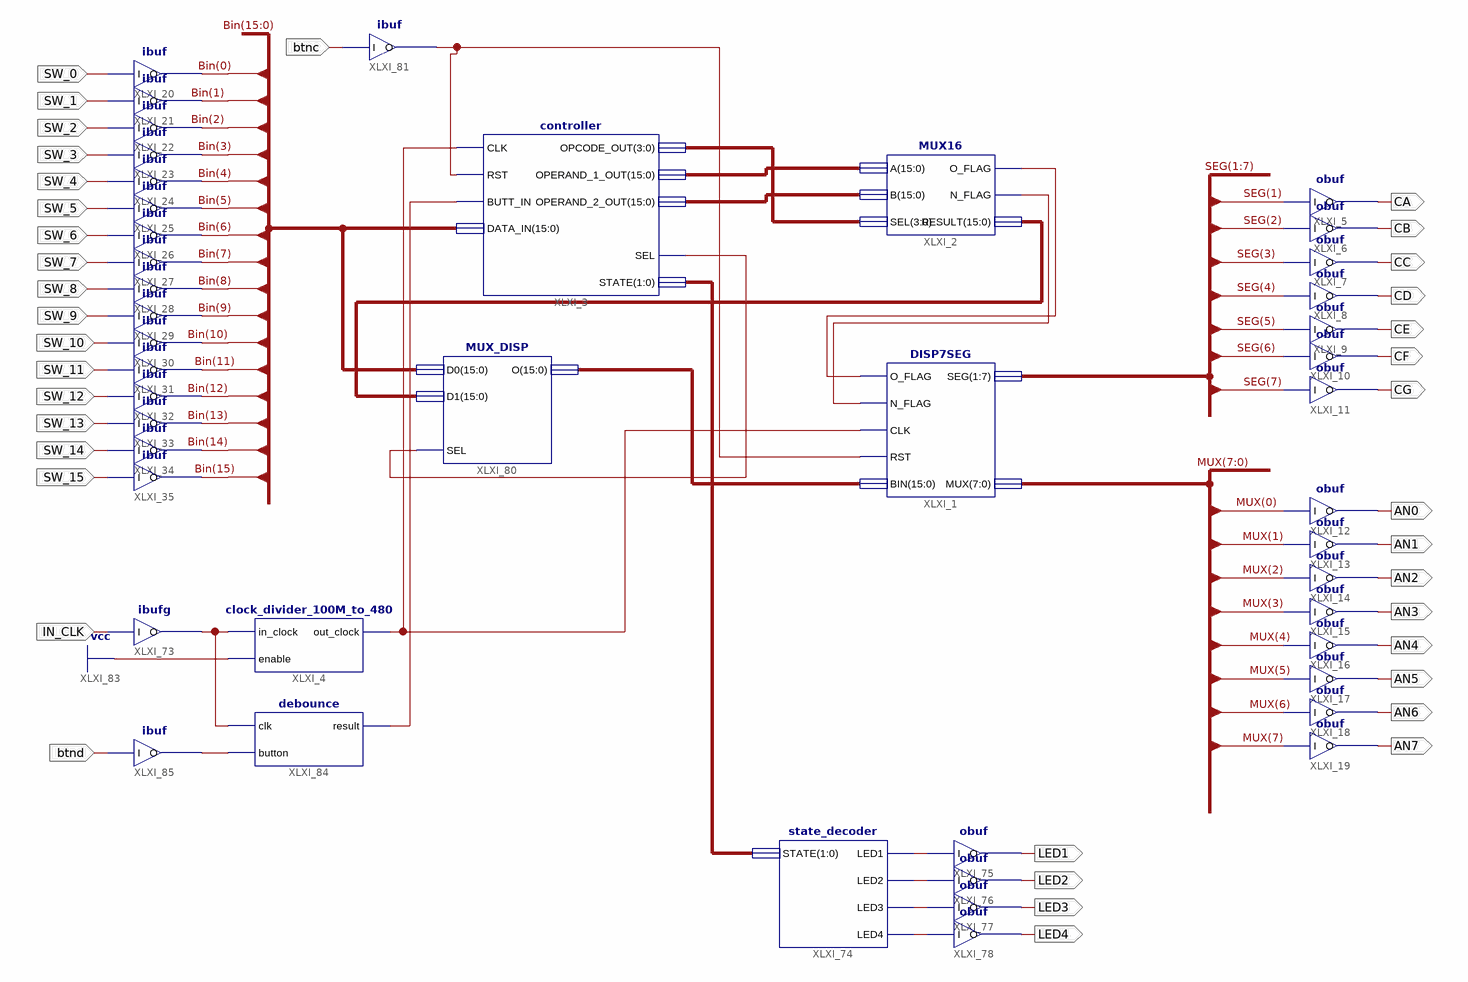
[diagram p0: schematic sheet 1]
// Xilinx ISE schematic Calculator_sch.sch (artix7) as structural Verilog: 45 symbols, 38 ports
module Calculator_sch (
  input  SW_15,
  input  SW_14,
  input  SW_13,
  input  SW_12,
  input  SW_11,
  input  SW_10,
  input  SW_9,
  input  SW_8,
  input  SW_7,
  input  SW_6,
  input  SW_5,
  input  SW_4,
  input  SW_3,
  input  SW_2,
  input  SW_1,
  input  SW_0,
  input  IN_CLK,
  input  btnc,
  input  btnd,
  output CA,
  output CB,
  output CC,
  output CD,
  output CE,
  output CF,
  output CG,
  output AN0,
  output AN1,
  output AN2,
  output AN3,
  output AN4,
  output AN5,
  output AN6,
  output AN7,
  output LED1,
  output LED2,
  output LED3,
  output LED4
);

  wire XLXN_5, XLXN_6, XLXN_155, XLXN_157, XLXN_158, XLXN_159, XLXN_160, XLXN_163, XLXN_167, XLXN_168,
       XLXN_179, XLXN_180;
  wire [1:0] XLXN_156;
  wire [3:0] XLXN_152;
  wire [7:0] MUX;
  wire [7:1] SEG;
  wire [15:0] Bin, XLXN_60, XLXN_151, XLXN_153, XLXN_154;

  DISP7SEG XLXI_1 (
    .O_FLAG(XLXN_5), .N_FLAG(XLXN_6), .CLK(XLXN_180), .RST(XLXN_163), .BIN(XLXN_60),
    .SEG({SEG[1], SEG[2], SEG[3], SEG[4], SEG[5], SEG[6], SEG[7]}), .MUX(MUX));
  MUX16 XLXI_2 (.A(XLXN_153), .B(XLXN_154), .SEL(XLXN_152), .O_FLAG(XLXN_5), .N_FLAG(XLXN_6), .RESULT(XLXN_151));
  controller XLXI_3 (
    .CLK(XLXN_180), .RST(XLXN_163), .BUTT_IN(XLXN_168), .DATA_IN(Bin), .OPCODE_OUT(XLXN_152),
    .OPERAND_1_OUT(XLXN_153), .OPERAND_2_OUT(XLXN_154), .SEL(XLXN_155), .STATE(XLXN_156));
  clock_divider_100M_to_480 XLXI_4 (.in_clock(XLXN_179), .enable(1'b1), .out_clock(XLXN_180));
  obuf XLXI_5 (.I(SEG[1]), .O(CA));
  obuf XLXI_6 (.I(SEG[2]), .O(CB));
  obuf XLXI_7 (.I(SEG[3]), .O(CC));
  obuf XLXI_8 (.I(SEG[4]), .O(CD));
  obuf XLXI_9 (.I(SEG[5]), .O(CE));
  obuf XLXI_10 (.I(SEG[6]), .O(CF));
  obuf XLXI_11 (.I(SEG[7]), .O(CG));
  obuf XLXI_12 (.I(MUX[0]), .O(AN0));
  obuf XLXI_13 (.I(MUX[1]), .O(AN1));
  obuf XLXI_14 (.I(MUX[2]), .O(AN2));
  obuf XLXI_15 (.I(MUX[3]), .O(AN3));
  obuf XLXI_16 (.I(MUX[4]), .O(AN4));
  obuf XLXI_17 (.I(MUX[5]), .O(AN5));
  obuf XLXI_18 (.I(MUX[6]), .O(AN6));
  obuf XLXI_19 (.I(MUX[7]), .O(AN7));
  ibuf XLXI_35 (.I(SW_15), .O(Bin[15]));
  ibuf XLXI_34 (.I(SW_14), .O(Bin[14]));
  ibuf XLXI_33 (.I(SW_13), .O(Bin[13]));
  ibuf XLXI_32 (.I(SW_12), .O(Bin[12]));
  ibuf XLXI_31 (.I(SW_11), .O(Bin[11]));
  ibuf XLXI_30 (.I(SW_10), .O(Bin[10]));
  ibuf XLXI_29 (.I(SW_9), .O(Bin[9]));
  ibuf XLXI_28 (.I(SW_8), .O(Bin[8]));
  ibuf XLXI_27 (.I(SW_7), .O(Bin[7]));
  ibuf XLXI_26 (.I(SW_6), .O(Bin[6]));
  ibuf XLXI_25 (.I(SW_5), .O(Bin[5]));
  ibuf XLXI_24 (.I(SW_4), .O(Bin[4]));
  ibuf XLXI_23 (.I(SW_3), .O(Bin[3]));
  ibuf XLXI_22 (.I(SW_2), .O(Bin[2]));
  ibuf XLXI_21 (.I(SW_1), .O(Bin[1]));
  ibuf XLXI_20 (.I(SW_0), .O(Bin[0]));
  ibufg XLXI_73 (.I(IN_CLK), .O(XLXN_179));
  state_decoder XLXI_74 (.STATE(XLXN_156), .LED1(XLXN_157), .LED2(XLXN_158), .LED3(XLXN_159), .LED4(XLXN_160));
  obuf XLXI_75 (.I(XLXN_157), .O(LED1));
  obuf XLXI_76 (.I(XLXN_158), .O(LED2));
  obuf XLXI_77 (.I(XLXN_159), .O(LED3));
  obuf XLXI_78 (.I(XLXN_160), .O(LED4));
  MUX_DISP XLXI_80 (.D0(Bin), .D1(XLXN_151), .O(XLXN_60), .SEL(XLXN_155));
  ibuf XLXI_81 (.I(btnc), .O(XLXN_163));
  debounce XLXI_84 (.clk(XLXN_179), .button(XLXN_167), .result(XLXN_168));
  ibuf XLXI_85 (.I(btnd), .O(XLXN_167));
endmodule
